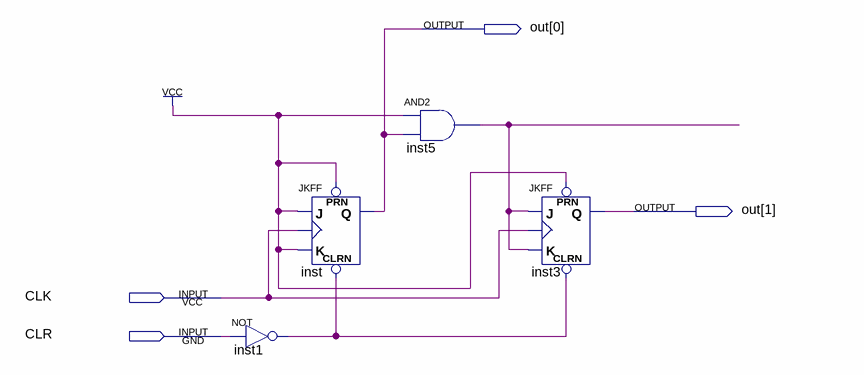
[diagram p0: schematic sheet]
// Quartus schematic 4SyncCounter.bdf as structural Verilog: 4 symbols, 4 pins
module \4SyncCounter  (
  input  CLK,
  input  CLR,
  output [1:0] out
);

  wire inst1_out, inst5_out;

  not inst1 (inst1_out, CLR);
  JKFF inst (.PRN(1'b1), .CLRN(inst1_out), .K(1'b1), .J(1'b1), .CLK(CLK), .Q(out[0]));
  and inst5 (inst5_out, 1'b1, out[0]);
  JKFF inst3 (.PRN(1'b1), .CLRN(inst1_out), .K(inst5_out), .J(inst5_out), .CLK(CLK), .Q(out[1]));
endmodule
